# Altium schematic sheet Power.SchDoc: Power supply
size A4; Engineer: CT; SheetNumber: 3; SheetTotal: 5
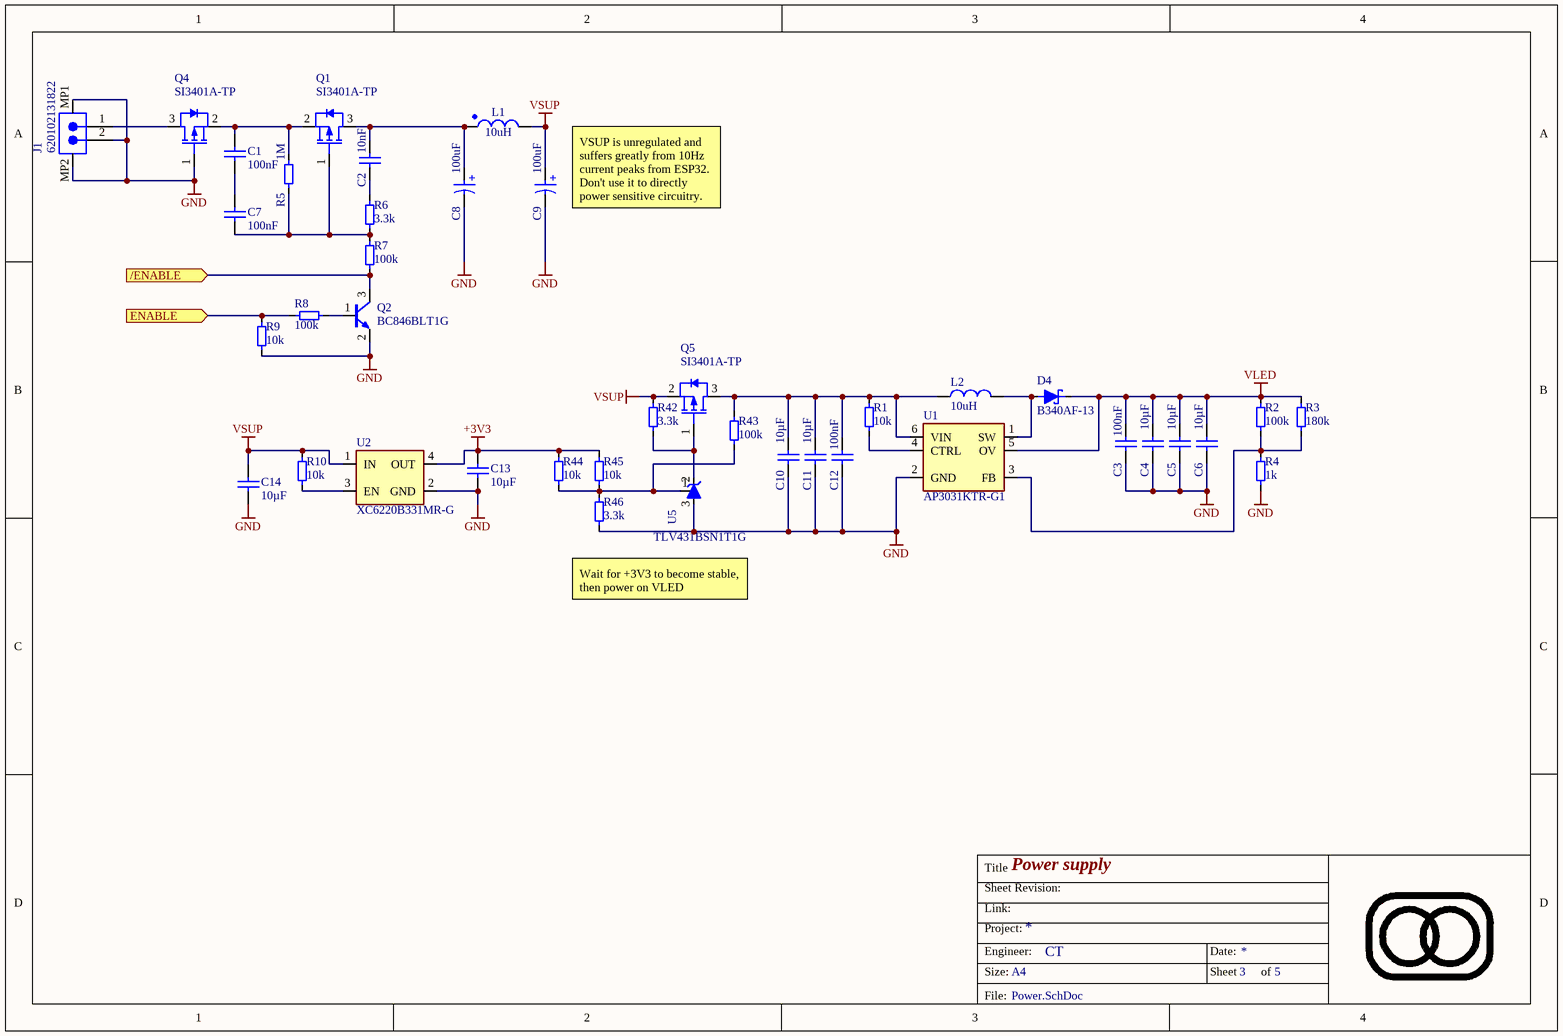
[diagram p0: Power.SchDoc]

## Parts
C1  value 100nF  [0603-C-N]  (hidden comment: Capacitor 100nF +/-10% 50V X7R 0603)
C2  value 10nF  [0603-C-N]  (hidden comment: Capacitor 10nF +/-10% 50V X7R 0603)
C3  value 100nF  [0603-C-N]  (hidden comment: Capacitor 100nF +/-10% 50V X7R 0603)
C4  value 10µF  [WCAP-CSGP_1210_L3.2W2.5H2.5]  (hidden comment: Capacitor 10µF +/-10% 50V X7R 1210)
C5  value 10µF  [WCAP-CSGP_1210_L3.2W2.5H2.5]  (hidden comment: Capacitor 10µF +/-10% 50V X7R 1210)
C6  value 10µF  [WCAP-CSGP_1210_L3.2W2.5H2.5]  (hidden comment: Capacitor 10µF +/-10% 50V X7R 1210)
C7  value 100nF  [0603-C-N]  (hidden comment: Capacitor 100nF +/-10% 50V X7R 0603)
C8  Capacitance: 100uF  [WCAP-ASLI_D6.3H5.5]  (hidden comment: 865080343009)
C9  Capacitance: 100uF  [WCAP-ASLI_D6.3H5.5]  (hidden comment: 865080343009)
C10  value 10µF  [1206-C-N]  (hidden comment: Capacitor 10µF +/-10% 10V X7R 1206)
C11  value 10µF  [1206-C-N]  (hidden comment: Capacitor 10µF +/-10% 10V X7R 1206)
C12  value 100nF  [0603-C-N]  (hidden comment: Capacitor 100nF +/-10% 50V X7R 0603)
C13  value 10µF  [1206-C-N]  (hidden comment: Capacitor 10µF +/-10% 10V X7R 1206)
C14  value 10µF  [1206-C-N]  (hidden comment: Capacitor 10µF +/-10% 10V X7R 1206)
D4  B340AF-13  [DO-214AC_UNI]
J1  620102131822  [620102131822]
L1  Inductance: 10uH  [WE-MAIA_4030]  (hidden comment: 78438357100)
L2  value 10uH  [WE-PMI_1008_L2.5W2H1.2]  (hidden comment: DFE252012F-100M=P2)
Q1  SI3401A-TP  [SOT-23-3-N]
Q2  BC846BLT1G  [SOT-23-3-N]
Q4  SI3401A-TP  [SOT-23-3-N]
Q5  SI3401A-TP  [SOT-23-3-N]
R1  value 10k  [0603-R-N]  (hidden comment: Resistor 10k +/-1% 50V 0603)
R2  value 100k  [0603-R-N]  (hidden comment: Resistor 100k +/-1% 50V 0603)
R3  value 180k  [0603-R-N]  (hidden comment: Resistor 180k +/-1% 75V 0603)
R4  value 1k  [0603-R-N]  (hidden comment: Resistor 1k +/-1% 50V 0603)
R5  value 1M  [0603-R-N]  (hidden comment: Resistor 1M +/-1% 50V 0603)
R6  value 3.3k  [0603-R-N]  (hidden comment: Resistor 3.3k +/-1% 50V 0603)
R7  value 100k  [0603-R-N]  (hidden comment: Resistor 100k +/-1% 50V 0603)
R8  value 100k  [0603-R-N]  (hidden comment: Resistor 100k +/-1% 50V 0603)
R9  value 10k  [0603-R-N]  (hidden comment: Resistor 10k +/-1% 50V 0603)
R10  value 10k  [0603-R-N]  (hidden comment: Resistor 10k +/-1% 50V 0603)
R42  value 3.3k  [0603-R-N]  (hidden comment: Resistor 3.3k +/-1% 50V 0603)
R43  value 100k  [0603-R-N]  (hidden comment: Resistor 100k +/-1% 50V 0603)
R44  value 10k  [0603-R-N]  (hidden comment: Resistor 10k +/-1% 50V 0603)
R45  value 10k  [0603-R-N]  (hidden comment: Resistor 10k +/-1% 50V 0603)
R46  value 3.3k  [0603-R-N]  (hidden comment: Resistor 3.3k +/-1% 50V 0603)
U1  AP3031KTR-G1  [SOT-23-6]
U2  XC6220B331MR-G  [SOT25-N]
U5  TLV431BSN1T1G  [SOT-23-3-N]

## Ports
/ENABLE (in), ENABLE (in)

## Nets
+3V3: C13.2 R44.2 R45.2 U2.4(OUT)
GND: C3.1 C4.1 C5.1 C6.1 C8.2(N) C9.2(N) C10.1 C11.1 C12.1 C13.1 C14.1 J1.2 J1.MP1 J1.MP2 Q2.2(E) Q4.1(GATE) R4.2 R9.1 R46.2 U1.2(GND) U2.2(GND) U5.3(A)
VLED: C3.2 C4.2 C5.2 C6.2 D4.1(K) R2.1 R3.2 U1.5(OV)
VSUP: C9.1(P) C14.2 L1.2 Q5.2(SOURCE) R10.2 R42.1 U2.1(IN)
/ENABLE: Q2.3(C) R7.2 ; port /ENABLE
ENABLE: R8.1 R9.2 ; port ENABLE
NetC1_1: C1.1 C7.1
NetC1_2: C1.2 Q1.2(SOURCE) Q4.2(SOURCE) R5.2
NetC2_1: C2.1 R6.1
NetC2_2: C2.2 C8.1(P) L1.1 Q1.3(DRAIN)
NetC7_2: C7.2 Q1.1(GATE) R5.1 R6.2 R7.1
NetC10_2: C10.2 C11.2 C12.2 L2.1 Q5.3(DRAIN) R1.2 R43.2 U1.6(VIN)
NetD4_2: D4.2(A) L2.2 U1.1(SW)
NetJ1_1: J1.1 Q4.3(DRAIN)
NetQ2_1: Q2.1(B) R8.2
NetQ5_1: Q5.1(GATE) R42.2 U5.2(C)
NetR1_1: R1.1 U1.4(CTRL)
NetR2_2: R2.2 R3.1 R4.1 U1.3(FB)
NetR10_1: R10.1 U2.3(EN)
NetR43_1: R43.1 R44.1 R45.1 R46.1 U5.1(rEF)

## Notes on the sheet
- (near C9) VSUP is unregulated and suffers greatly from 10Hz current peaks from ESP32.  Don't use it to directly power sensitive circuitry.
- Wait for +3V3 to become stable, then power on VLED
- Title
- Sheet Revision:
- Link:
- Size:
- Project:
- Engineer:
- A4
- Date:
- Sheet
- of
- File:
- (in symbol CMP-112-000042-5) +

## Library data of the parts
C1 C3 C7 C12 = CMP-072-000619-13: WCAP-CSGP Multilayer Ceramic Chip Capacitor, General Purpose, size 0603, X7R, 100nF, 50VDC; Capacitor Type: MLCC; Tolerance: 10%; Dissipation Factor: 3%; Technical Reference: X7R0603104K050DFCT10000; Insulation Resistance: 5GO; Length: 1.6mm; Dielectric: X7R; Height: 0.8mm; Pins: 2; Min Operating Temperature: -55°C; Usage: General Purpose; Mounting Technology: SMT; Case/Package: 0603; Width: 0.8mm; Max Operating Temperature: 125°C; Voltage Rating: 50V; Design Item ID: 885012206095; ComponentLink1URL: https://www.we-online.com/redexpert/article/885012206095?ad; ComponentLink2URL: https://www.we-online.com/redexpert/spec/885012206095?ad; Packaging: Tape and Reel; ComponentLink1Description: Website Link; Match Code: WCAP-CSGP; ComponentLink2Description: Datasheet Link; Source: WCAP-CSGP.SchLib; JLCPCB Part #: C14663
C2 = CMP-001-00089-15: Capacitor MLCC, General Purpose, size 0603, X7R, 10nF, +/-10%, 50V; Tolerance: 10%; Voltage Rating: 50V; RoHS Compliant: True; Mounting Technology: SMT; Max Operating Temperature: 125°C; Length: 1.6mm; Capacitor Type: MLCC; Case/Package: 0603; JLCPCB Part #: C57112; Min Operating Temperature: -55°C; Usage: General Purpose; Packaging: Cut Tape; Width: 0.8mm; REACH SVHC: No SVHC; Height: 0.8mm; Dielectric: X7R; Pins: 2
C4-C6 = CMP-072-000922-13: WCAP-CSGP Multilayer Ceramic Chip Capacitor, General Purpose, size 1210, X7R, 10µF, 50VDC; Capacitor Type: MLCC; Dissipation Factor: 10%; Technical Reference: X7R1210106K050DFCT10000; Insulation Resistance: 0.01GO; Dielectric: X7R; ComponentLink2Description: Datasheet Link; Length: 3.2mm; Height: 2.5mm; Width: 2.5mm; Match Code: WCAP-CSGP; Usage: General Purpose; Case/Package: 1210; ComponentLink1Description: Website Link; JLCPCB Part #: C2918502; Source: WCAP-CSGP.SchLib; ComponentLink2URL: https://www.we-online.com/redexpert/spec/885012209073?ad; Min Operating Temperature: -55°C; Voltage Rating: 50V; Max Operating Temperature: 125°C; Tolerance: 10%; Design Item ID: 885012209073; Mounting Technology: SMT; Pins: 2; Packaging: Tape and Reel; ComponentLink1URL: https://www.we-online.com/redexpert/article/885012209073?ad
C8 C9 = CMP-112-000042-5: WCAP-ASLI Aluminum Electrolytic Capacitor, V-Chip, D6.3 x H5.5mm, 100uF, 16V; Manufacturer: Wurth Elektronik; Endurance: 2000h; Technical Reference: ASED055101M016DVCTBB000; Ripple Current: 255mA; Dissipation Factor: 16%; Capacitance Tolerance: +/-20%; Leakage Current: 16uA; Pin Count: 2; Category: Aluminum Electrolytic Capacitors; Packaging: Tape and Reel; ComponentLink2Description: Datasheet Link; Diameter: 6.3mm; Height: 5.5mm; Match Code: WCAP-ASLI; Source: WCAP-ASLI.SchLib; Operating Temperature Min: -55°C; ComponentLink1Description: Website Link; ComponentLink1URL: https://www.we-online.com/redexpert/article/865080343009?ad; ComponentLink2URL: https://www.we-online.com/redexpert/spec/865080343009?ad; Mount: Surface Mount; Manufacturer Part Number: 865080343009; Rated Voltage (DC): 16V; Component Type: Standard; Design Item ID: 865080343009; Operating Temperature Max: 105°C; JLCPCB Part #: C111600
C10 C11 C13 C14 = CMP-072-000777-12: WCAP-CSGP Multilayer Ceramic Chip Capacitor, General Purpose, size 1206, X7R, 10µF, 10VDC; Dissipation Factor: 10%; Insulation Resistance: 0.01GO; Capacitor Type: MLCC; Technical Reference: X7R1206106K010DFCT10000; Width: 1.6mm; Source: WCAP-CSGP.SchLib; ComponentLink2URL: https://www.we-online.com/redexpert/spec/885012208018?ad; Tolerance: 10%; Packaging: Tape and Reel; Voltage Rating: 10V; ComponentLink2Description: Datasheet Link; Usage: General Purpose; Design Item ID: 885012208018; Pins: 2; Max Operating Temperature: 125°C; Height: 1.6mm; ComponentLink1URL: https://www.we-online.com/redexpert/article/885012208018?ad; Dielectric: X7R; Case/Package: 1206; ComponentLink1Description: Website Link; Min Operating Temperature: -55°C; Length: 3.2mm; Match Code: WCAP-CSGP; Mounting Technology: SMT; JLCPCB Part #: C97953
D4 = CMP-004-00050-4: Diode 40 V 3A Surface Mount SMAF; Forward Voltage: 500 mV @ 3 A; Max Reverse Voltage (DC): 40V; Packaging: Cut Tape; RoHS Compliant: Yes; Case/Package: SMA; Mounting Technology: Surface Mount; Forward Current: 3A; Series: -; JLCPCB Part #: C5310924
J1 = CMP-047-000040-11: WR-WTB SMT Male Horizontal Shrouded Header, pitch 2mm, 2p; Pin Number: 2; Working Voltage: 100VAC; Withstanding Voltage: 800VAC; Rated Current: 2A; Contact Resistance: 20mOhm; Pitch: 2mm; Operating Temperature: -25 to +85degC; ComponentLink1Description: Manufacturer; ComponentLink1URL: http://www.we-online.de; Gender: Male; Packaging: Tape and Reel; Pin Count: 2; Component Type: Standard; Mounting Technology: SMT; Type: Horizontal; Part Number: 620102131822; ComponentLink2Description: Datasheet; Publisher: Wurth Elektronik; Source: WR-WTB_2.00mm.SchLib; Design Item ID: 620102131822; Published Date: January 2020; JLCPCB Part #: C295747; ComponentLink2URL: https://www.we-online.com/catalog/datasheet/620102131822.pdf
L1 = CMP-116-000112-5: WE-MAIA SMT Power Inductor, size 4030, 10uH, 3.05A, 110mOhm; Manufacturer: Wurth Elektronik; Saturation Current @ 30%: 5.95A; Saturation Current @ 10%: 3A; Self Resonant Frequency: 15MHz; Case/Size Code: 4030; Width: 4.1mm; Packaging: Tape and Reel; Length: 4.1mm; JLCPCB Part #: C167879; ComponentLink2Description: Datasheet Link; ComponentLink2URL: https://www.we-online.com/redexpert/spec/78438357100?ad; Height: 3.1mm; Match Code: WE-MAIA; Design Item ID: 78438357100; Operating Temperature Max: 125°C; Mount: Surface Mount; Pin Count: 2; ComponentLink1Description: Website Link; DC Resistance Max: 110mOhm; Rated Current: 3.05A; Component Type: Standard; Automotive: Yes; Category: Power Inductors; Operating Temperature Min: -40°C; Source: WE-MAIA.SchLib; Manufacturer Part Number: 78438357100; ComponentLink1URL: https://www.we-online.com/redexpert/article/78438357100?ad
L2 = CMP-002-001561-2: Inductor Power Chip Shielded Wirewound 10uH 20% 1MHz Metal 0.95A 0.48Ohm DCR 1008 T/R; Current Rating: 950mA; Saturation Current: 1.6A; Core Material: Ferrite; DC Resistance (DCR): 480mR; Min Operating Temperature: -40°C; Shielding: Shielded; Width: 0.079inch; Series: DFE252012F; Max Operating Temperature: 125°C; Packaging: Cut Tape; Height - Seated (Max): 0.047inch; Case Code (Imperial): 1008; Test Frequency: 1MHz; Mounting Technology: Surface Mount; Case/Package: 1008; Length: 0.098inch; Case Code (Metric): 2520; Tolerance: 20%; JLCPCB Part #: C2042388
Q1 Q4 Q5 = CMP-013-00056-10: Trans Mosfet P-ch 30V 4.2A 3-PIN SOT-23 T/r; Transistor Type: PMOS; Max Power Dissipation: 400mW; Vgs(th) (Max) @ Id: -1.3V @ 250µA; Input Capacitance: 1.05nF; Rds On Max: 60mR; Series: -; JLCPCB Part #: C15127; Id - Continuous Drain Current: 4.2A; Packaging: Cut Tape; Mounting Technology: Surface Mount; Vds Max: 30V; RoHS Compliant: Yes; Min Operating Temperature: -55°C; Case/Package: SOT-23-3; Max Operating Temperature: 150°C
Q2 = CMP-013-00048-14: NPN Ic=100mA Vceo=65V hfe=200~450 P=225mW SOT-23; Ic Max: 100mA; Vce Max: 65V; Transistor Type: NPN; Case/Package: SOT-23-3; JLCPCB Part #: C82477
R1 R9 R10 R44 R45 = CMP-009-00017-23: Chip Resistor, Thick Film, General Purpose, 0603, 100mW, 50V, 10 kOhm, +/-1%; Tolerance: 1%; Elements: 1; Power Rating: 100mW; RoHS Compliant: True; Voltage Rating: 50V; Mounting Technology: SMT; Usage: General Purpose; JLCPCB Part #: C25804; Max Operating Temperature: 155°C; Case/Package: 0603; Pins: 2; Resistor Type: Thick Film; Min Operating Temperature: -55°C
R2 R7 R8 R43 = CMP-009-00023-24: Chip Resistor, Thick Film, General Purpose, 0603, 100mW, 50V, 100 kOhm, +/-1%; Elements: 1; Tolerance: 1%; Usage: General Purpose; Mounting Technology: SMT; Power Rating: 100mW; Case/Package: 0603; Voltage Rating: 50V; Max Operating Temperature: 155°C; Resistor Type: Thick Film; RoHS Compliant: True; Pins: 2; Min Operating Temperature: -55°C; JLCPCB Part #: C25803
R3 = CMP-009-00290-7: Res Thick Film 0603 180K Ohm 1% 0.1W(1/10W) ±100ppm/C Pad SMD T/R; Voltage Rating: 50V; Temperature Coefficient: 100ppm/°C; Max Power Dissipation: 100mW; Case Code (Metric): 1608; Termination: SMD/SMT; Width: 0.8mm; Resistance Tolerance: 1%; Packaging: Tape and Reel; Resistor Type: Thick Film; Case Code (Imperial): 0603; Working Voltage: 75V; Tolerance: 1%; Lead Free: Lead Free; JLCPCB Part #: C22827; Series: RC; Length: 1.6mm; Power Rating: 100mW; Max Operating Temperature: 155°C; Military Standard: Not; RoHS Compliant: Yes; Depth: 0.8mm; Pins: 2; Technology: THICK FILM; Construction: Rectangular; Case/Package: 0603; Number of Terminations: 2; Min Operating Temperature: -55°C; Height: 0.45mm; Package Quantity: 5000; Voltage Rating (DC): 50V; Features: Moisture Resistant
R4 = CMP-009-00014-24: Chip Resistor, Thick Film, General Purpose, 0603, 100mW, 50V, 1 kOhm, +/-1%; Tolerance: 1%; Elements: 1; Power Rating: 100mW; Voltage Rating: 50V; RoHS Compliant: True; Usage: General Purpose; Max Operating Temperature: 155°C; Mounting Technology: SMT; Min Operating Temperature: -55°C; Case/Package: 0603; Pins: 2; Resistor Type: Thick Film; JLCPCB Part #: C21190
R5 = CMP-009-00234-14: Chip Resistor, Thick Film, General Purpose, 0603, 100mW, 50V, 1 MOhm, +/-1%; Elements: 1; Tolerance: 1%; Voltage Rating: 50V; Max Operating Temperature: 155°C; Mounting Technology: SMT; Resistor Type: Thick Film; RoHS Compliant: Yes; Power Rating: 100mW; Usage: General Purpose; Pins: 2; Min Operating Temperature: -55°C; JLCPCB Part #: C22935; Case/Package: 0603
R6 R42 R46 = CMP-009-00243-14: Chip Resistor, Thick Film, General Purpose, 0603, 100mW, 50V, 3.3 kOhm, +/-1%; Tolerance: 1%; Elements: 1; Power Rating: 100mW; Voltage Rating: 50V; RoHS Compliant: Yes; Usage: General Purpose; Max Operating Temperature: 155°C; Mounting Technology: SMT; Min Operating Temperature: -55°C; Case/Package: 0603; Pins: 2; Resistor Type: Thick Film; JLCPCB Part #: C22978
U1 = CMP-002-001562-1: AP3031 Series 2.7 to 16 Vin 1.4 A White LED Step Up Converter-SOT-23-6; Frequency: 1MHz; Number of Channels: 1; Dimming: PWM; Max Output Voltage: 38V; Min Input Voltage (DC): 2.7V; Max Output current: 260mA; Topology: Boost; Operating Frequency: 1 MHz; Max Supply Current: 5mA; Output Current: 1.4A; Max Supply Voltage: 16V; Output Type: Adjustable; Mounting Technology: Surface Mount; Switching Frequency: 1MHz; RoHS Compliant: Yes; Package Quantity: 3000; Height: 1.3mm; Lead Free: Lead Free; Weight: 0.000529oz; Width: 1.7mm; JLCPCB Part #: C82636; Pins: 6; Case/Package: SOT-23-6; Number of Outputs: 1; Series: -; Packaging: Tape and Reel; Max Operating Temperature: 85°C; Max Input Voltage (DC): 16V; Output Current per Channel: 1.4A; Min Input Voltage: 2.7V; Min Operating Temperature: -40°C; Length: 3.02mm
U2 = CMP-019-00081-9: Fixed LDO 3.3V, 1%, 1A, Iq 108uA, -40°C to 85°C; pin to pad: 4>5; Min Input Voltage: 4V; Max Input Voltage: 6V; Number of Outputs: 1; Case/Package: SOT-23-5; Max Operating Temperature: 85°C; Output Type: Fixed; Output Voltage: 3.3V; Quiescent Current: 108uA; Mount: SMT; Number of Regulators: 1; Min Operating Temperature: -40°C; Accuracy: 1%; JLCPCB Part #: C86534; Output Current: 1A
U5 = CMP-019-00078-10: Adjustable Shunt Voltage Reference 1.24 - 16V; +/-0.5%; 3-Pin SOT-23; Cathode Current: 80uA; Output Current: 20mA; Max Input Voltage: 18V; Tolerance: 0.5%; Min Output Voltage: 1.24V; Reference Type: Shunt,Adjustable; Number of Channels: 1; Radiation Hardening: No; Max Operating Temperature: 85°C; Case/Package: SOT-23-3; Lead Free: Lead Free; Sink current: 20mA; Width: 1.4mm; Mount: Surface Mount; Halogen Free: Halogen Free; JLCPCB Part #: C91075; Package Quantity: 3000; RoHS Compliant: Yes; Packaging: Tape and Reel; Max Output Voltage: 16V; Length: 3.04mm; Reach SVHC Compliant: Yes; Series: -; Output Voltage: 16V; Min Operating Temperature: -40°C; Output Type: Adjustable; Number of Pins: 3; Max Output Current: 20mA; Height: 1.01mm; Reference Voltage: 1.24V; Output voltage (max): 16V; Accuracy: 0.5%